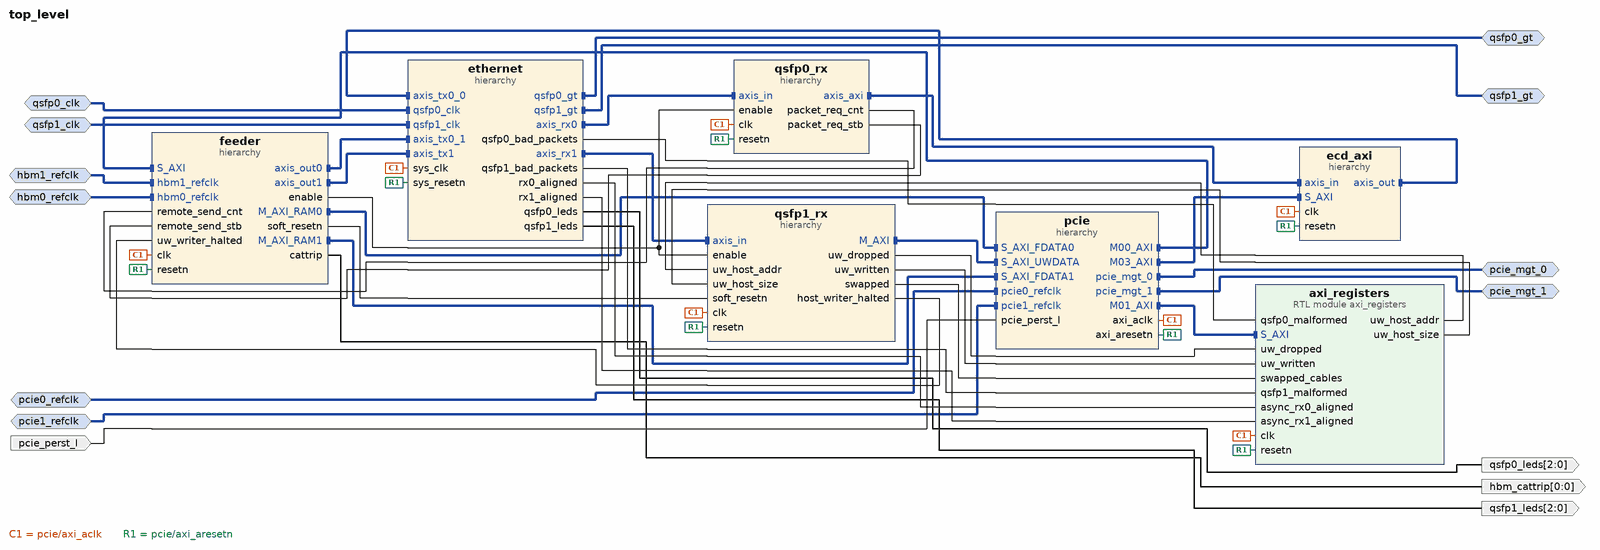
[diagram p0: block diagram of the top level]
# Vivado block design top_level, xcu55c-fsvh2892-2L-e, Vivado 2024.2
create_bd_design top_level

create_bd_intf_port -mode Slave -vlnv xilinx.com:interface:diff_clock_rtl:1.0 pcie0_refclk
create_bd_intf_port -mode Master -vlnv xilinx.com:interface:pcie_7x_mgt_rtl:1.0 pcie_mgt_0
create_bd_intf_port -mode Master -vlnv xilinx.com:interface:pcie_7x_mgt_rtl:1.0 pcie_mgt_1
create_bd_intf_port -mode Slave -vlnv xilinx.com:interface:diff_clock_rtl:1.0 pcie1_refclk
create_bd_intf_port -mode Master -vlnv xilinx.com:interface:gt_rtl:1.0 qsfp0_gt
create_bd_intf_port -mode Slave -vlnv xilinx.com:interface:diff_clock_rtl:1.0 qsfp0_clk
set_property -dict {CONFIG.FREQ_HZ 161132812} [get_bd_intf_ports qsfp0_clk]
create_bd_intf_port -mode Slave -vlnv xilinx.com:interface:diff_clock_rtl:1.0 qsfp1_clk
set_property -dict {CONFIG.FREQ_HZ 161132812} [get_bd_intf_ports qsfp1_clk]
create_bd_intf_port -mode Master -vlnv xilinx.com:interface:gt_rtl:1.0 qsfp1_gt
create_bd_intf_port -mode Slave -vlnv xilinx.com:interface:diff_clock_rtl:1.0 hbm0_refclk
create_bd_intf_port -mode Slave -vlnv xilinx.com:interface:diff_clock_rtl:1.0 hbm1_refclk
create_bd_port -dir O -from 0 -to 0 hbm_cattrip
create_bd_port -dir I -type rst pcie_perst_l
create_bd_port -dir O -from 2 -to 0 qsfp0_leds
create_bd_port -dir O -from 2 -to 0 qsfp1_leds

create_bd_cell -type hier pcie
create_bd_cell -type hier feeder
create_bd_cell -type hier ethernet
create_bd_cell -type hier qsfp0_rx
create_bd_cell -type module -reference axi_registers axi_registers
create_bd_cell -type hier qsfp1_rx
create_bd_cell -type hier ecd_axi

# ---- hierarchy /pcie ----
current_bd_instance /pcie
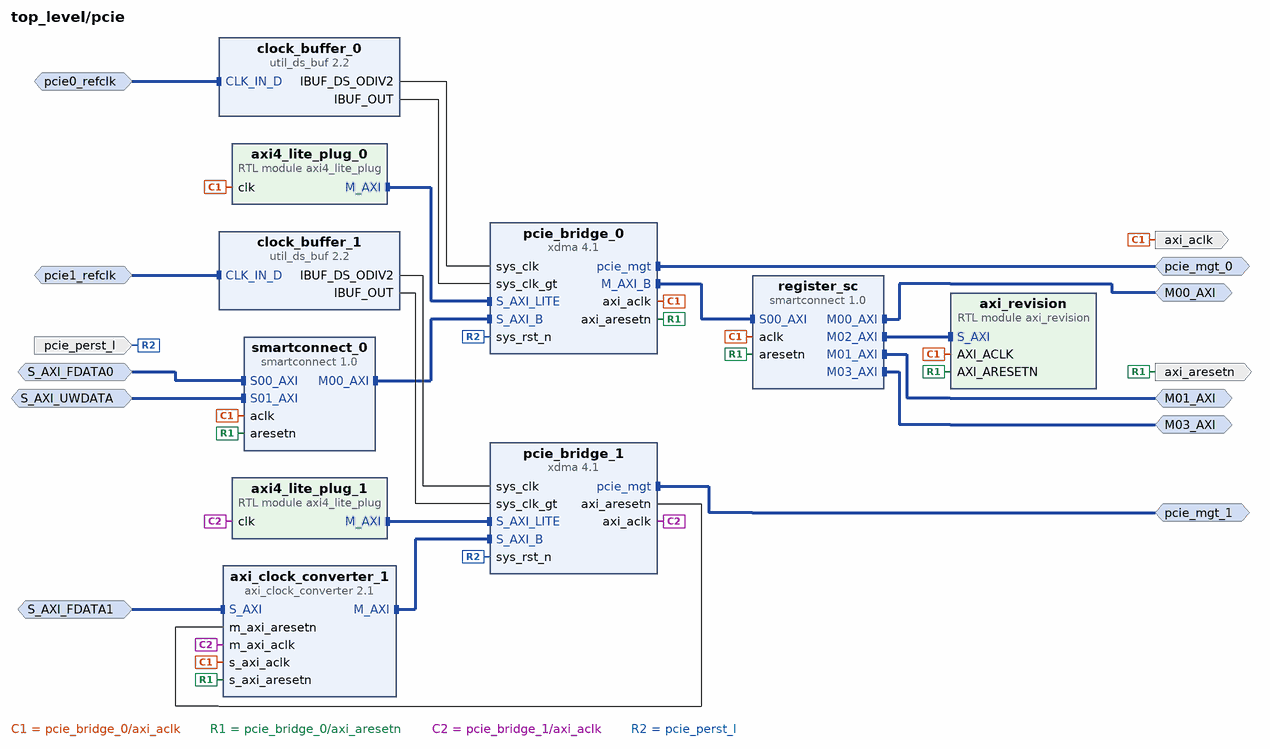
[diagram p1: block diagram inside /pcie]
create_bd_intf_pin -mode Slave -vlnv xilinx.com:interface:diff_clock_rtl:1.0 pcie1_refclk
create_bd_intf_pin -mode Master -vlnv xilinx.com:interface:pcie_7x_mgt_rtl:1.0 pcie_mgt_0
create_bd_intf_pin -mode Master -vlnv xilinx.com:interface:pcie_7x_mgt_rtl:1.0 pcie_mgt_1
create_bd_intf_pin -mode Slave -vlnv xilinx.com:interface:diff_clock_rtl:1.0 pcie0_refclk
create_bd_intf_pin -mode Slave -vlnv xilinx.com:interface:aximm_rtl:1.0 S_AXI_FDATA1
create_bd_intf_pin -mode Slave -vlnv xilinx.com:interface:aximm_rtl:1.0 S_AXI_FDATA0
create_bd_intf_pin -mode Slave -vlnv xilinx.com:interface:aximm_rtl:1.0 S_AXI_UWDATA
create_bd_intf_pin -mode Master -vlnv xilinx.com:interface:aximm_rtl:1.0 M00_AXI
create_bd_intf_pin -mode Master -vlnv xilinx.com:interface:aximm_rtl:1.0 M01_AXI
create_bd_intf_pin -mode Master -vlnv xilinx.com:interface:aximm_rtl:1.0 M03_AXI
create_bd_pin -dir I -type rst pcie_perst_l
create_bd_pin -dir O axi_aresetn
create_bd_pin -dir O axi_aclk

create_bd_cell -type ip -vlnv xilinx.com:ip:util_ds_buf:2.2 clock_buffer_1
set_property -dict {CONFIG.C_BUF_TYPE IBUFDSGTE} [get_bd_cells clock_buffer_1]
create_bd_cell -type ip -vlnv xilinx.com:ip:xdma:4.1 pcie_bridge_0
set_property -dict [list \
  CONFIG.PF0_DEVICE_ID_mqdma 9048 \
  CONFIG.PF0_SRIOV_VF_DEVICE_ID A048 \
  CONFIG.PF2_DEVICE_ID_mqdma 9248 \
  CONFIG.PF3_DEVICE_ID_mqdma 9348 \
  CONFIG.axi_addr_width 64 \
  CONFIG.axi_data_width 512_bit \
  CONFIG.axisten_freq 250 \
  CONFIG.bridge_burst true \
  CONFIG.en_axi_slave_if true \
  CONFIG.en_gt_selection false \
  CONFIG.functional_mode AXI_Bridge \
  CONFIG.mode_selection Advanced \
  CONFIG.pcie_blk_locn PCIE4C_X1Y1 \
  CONFIG.pf0_bar0_scale Megabytes \
  CONFIG.pf0_bar0_size 1 \
  CONFIG.pf0_device_id 903F \
  CONFIG.pf0_msi_enabled false \
  CONFIG.pl_link_cap_max_link_speed 16.0_GT/s \
  CONFIG.pl_link_cap_max_link_width X8 \
  CONFIG.runbit_fix false \
  CONFIG.xlnx_ref_board None \
] [get_bd_cells pcie_bridge_0]
create_bd_cell -type ip -vlnv xilinx.com:ip:xdma:4.1 pcie_bridge_1
set_property -dict [list \
  CONFIG.PCIE_BOARD_INTERFACE Custom \
  CONFIG.PF0_DEVICE_ID_mqdma 9048 \
  CONFIG.PF0_SRIOV_VF_DEVICE_ID A048 \
  CONFIG.PF2_DEVICE_ID_mqdma 9248 \
  CONFIG.PF3_DEVICE_ID_mqdma 9348 \
  CONFIG.SYS_RST_N_BOARD_INTERFACE Custom \
  CONFIG.axi_addr_width 64 \
  CONFIG.axi_data_width 512_bit \
  CONFIG.axisten_freq 250 \
  CONFIG.bridge_burst true \
  CONFIG.en_axi_master_if false \
  CONFIG.en_axi_slave_if true \
  CONFIG.en_gt_selection true \
  CONFIG.functional_mode AXI_Bridge \
  CONFIG.mode_selection Advanced \
  CONFIG.pcie_blk_locn PCIE4C_X1Y0 \
  CONFIG.pf0_bar0_scale Megabytes \
  CONFIG.pf0_bar0_size 1 \
  CONFIG.pf0_device_id 9040 \
  CONFIG.pf0_msi_enabled false \
  CONFIG.pl_link_cap_max_link_speed 16.0_GT/s \
  CONFIG.pl_link_cap_max_link_width X8 \
  CONFIG.runbit_fix false \
  CONFIG.select_quad GTY_Quad_225 \
  CONFIG.xlnx_ref_board None \
] [get_bd_cells pcie_bridge_1]
create_bd_cell -type ip -vlnv xilinx.com:ip:util_ds_buf:2.2 clock_buffer_0
set_property -dict {CONFIG.C_BUF_TYPE IBUFDSGTE} [get_bd_cells clock_buffer_0]
create_bd_cell -type ip -vlnv xilinx.com:ip:smartconnect:1.0 smartconnect_0
set_property -dict {CONFIG.NUM_SI 2} [get_bd_cells smartconnect_0]
create_bd_cell -type module -reference axi4_lite_plug axi4_lite_plug_0
create_bd_cell -type module -reference axi4_lite_plug axi4_lite_plug_1
create_bd_cell -type ip -vlnv xilinx.com:ip:axi_clock_converter:2.1 axi_clock_converter_1
create_bd_cell -type ip -vlnv xilinx.com:ip:smartconnect:1.0 register_sc
set_property -dict {CONFIG.NUM_MI 4 CONFIG.NUM_SI 1} [get_bd_cells register_sc]
create_bd_cell -type module -reference axi_revision axi_revision

# ---- hierarchy /feeder ----
current_bd_instance /feeder
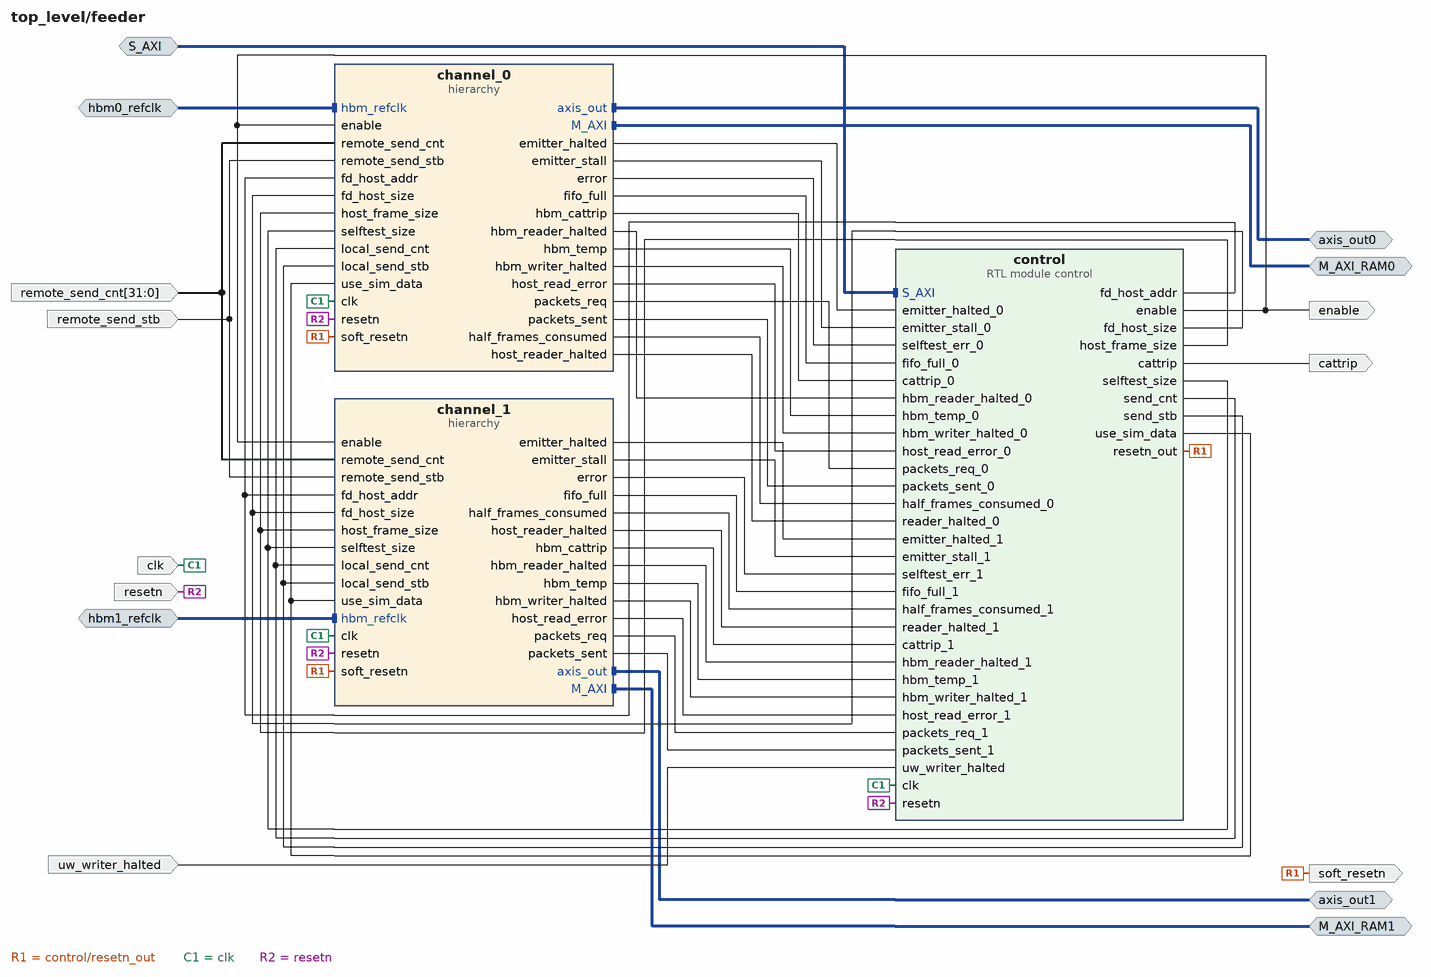
[diagram p2: block diagram inside /feeder]
create_bd_intf_pin -mode Slave -vlnv xilinx.com:interface:aximm_rtl:1.0 S_AXI
create_bd_intf_pin -mode Master -vlnv xilinx.com:interface:aximm_rtl:1.0 M_AXI_RAM0
create_bd_intf_pin -mode Master -vlnv xilinx.com:interface:axis_rtl:1.0 axis_out0
create_bd_intf_pin -mode Master -vlnv xilinx.com:interface:axis_rtl:1.0 axis_out1
create_bd_intf_pin -mode Master -vlnv xilinx.com:interface:aximm_rtl:1.0 M_AXI_RAM1
create_bd_intf_pin -mode Slave -vlnv xilinx.com:interface:diff_clock_rtl:1.0 hbm0_refclk
create_bd_intf_pin -mode Slave -vlnv xilinx.com:interface:diff_clock_rtl:1.0 hbm1_refclk
create_bd_pin -dir I -type clk clk
create_bd_pin -dir I -type rst resetn
create_bd_pin -dir I -from 31 -to 0 remote_send_cnt
create_bd_pin -dir I remote_send_stb
create_bd_pin -dir O cattrip
create_bd_pin -dir O enable
create_bd_pin -dir I uw_writer_halted
create_bd_pin -dir O soft_resetn

create_bd_cell -type hier channel_0
create_bd_cell -type hier channel_1
create_bd_cell -type module -reference control control

# ---- hierarchy /feeder/channel_0 ----
current_bd_instance /feeder/channel_0
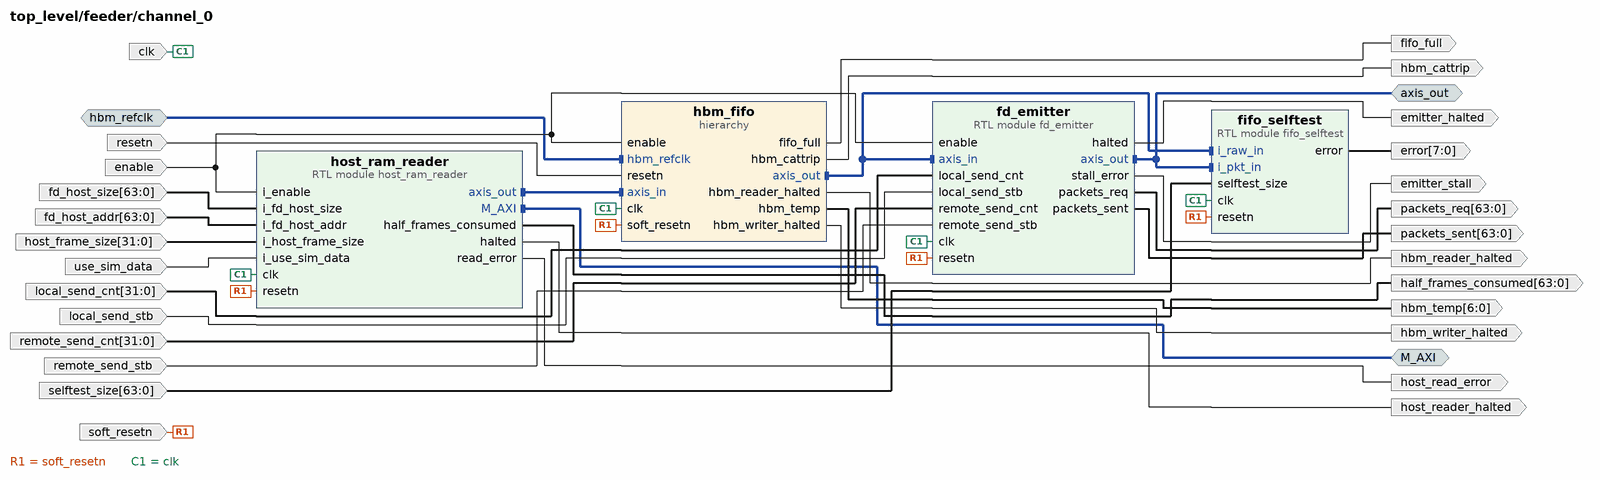
[diagram p3: block diagram inside /feeder/channel_0]
create_bd_intf_pin -mode Master -vlnv xilinx.com:interface:aximm_rtl:1.0 M_AXI
create_bd_intf_pin -mode Master -vlnv xilinx.com:interface:axis_rtl:1.0 axis_out
create_bd_intf_pin -mode Slave -vlnv xilinx.com:interface:diff_clock_rtl:1.0 hbm_refclk
create_bd_pin -dir I -type clk clk
create_bd_pin -dir I -type rst soft_resetn
create_bd_pin -dir I -from 31 -to 0 host_frame_size
create_bd_pin -dir I -from 63 -to 0 fd_host_addr
create_bd_pin -dir I -from 63 -to 0 fd_host_size
create_bd_pin -dir O -from 63 -to 0 half_frames_consumed
create_bd_pin -dir I enable
create_bd_pin -dir O host_reader_halted
create_bd_pin -dir I local_send_stb
create_bd_pin -dir I -from 31 -to 0 local_send_cnt
create_bd_pin -dir I remote_send_stb
create_bd_pin -dir I -from 31 -to 0 remote_send_cnt
create_bd_pin -dir I use_sim_data
create_bd_pin -dir O fifo_full
create_bd_pin -dir O -from 6 -to 0 hbm_temp
create_bd_pin -dir O hbm_cattrip
create_bd_pin -dir O -from 7 -to 0 error
create_bd_pin -dir O emitter_halted
create_bd_pin -dir O -from 63 -to 0 packets_req
create_bd_pin -dir O -from 63 -to 0 packets_sent
create_bd_pin -dir O host_read_error
create_bd_pin -dir O emitter_stall
create_bd_pin -dir O hbm_writer_halted
create_bd_pin -dir O hbm_reader_halted
create_bd_pin -dir I resetn
create_bd_pin -dir I -from 63 -to 0 selftest_size

create_bd_cell -type module -reference fd_emitter fd_emitter
set_property -dict {CONFIG.CHANNEL 0} [get_bd_cells fd_emitter]
create_bd_cell -type hier hbm_fifo
create_bd_cell -type module -reference fifo_selftest fifo_selftest
create_bd_cell -type module -reference host_ram_reader host_ram_reader

# ---- hierarchy /feeder/channel_0/hbm_fifo ----
current_bd_instance /feeder/channel_0/hbm_fifo
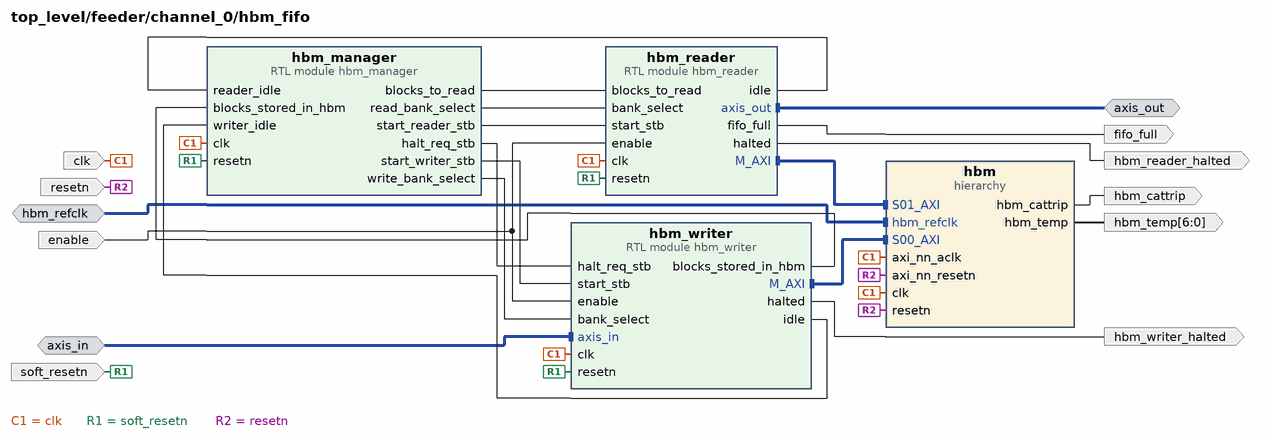
[diagram p4: block diagram inside /feeder/channel_0/hbm_fifo]
create_bd_intf_pin -mode Slave -vlnv xilinx.com:interface:axis_rtl:1.0 axis_in
create_bd_intf_pin -mode Master -vlnv xilinx.com:interface:axis_rtl:1.0 axis_out
create_bd_intf_pin -mode Slave -vlnv xilinx.com:interface:diff_clock_rtl:1.0 hbm_refclk
create_bd_pin -dir I clk
create_bd_pin -dir I soft_resetn
create_bd_pin -dir O fifo_full
create_bd_pin -dir O -from 6 -to 0 hbm_temp
create_bd_pin -dir O hbm_cattrip
create_bd_pin -dir O hbm_reader_halted
create_bd_pin -dir I enable
create_bd_pin -dir O hbm_writer_halted
create_bd_pin -dir I resetn

create_bd_cell -type module -reference hbm_manager hbm_manager
create_bd_cell -type module -reference hbm_reader hbm_reader
create_bd_cell -type module -reference hbm_writer hbm_writer
create_bd_cell -type hier hbm

# ---- hierarchy /feeder/channel_0/hbm_fifo/hbm ----
current_bd_instance /feeder/channel_0/hbm_fifo/hbm
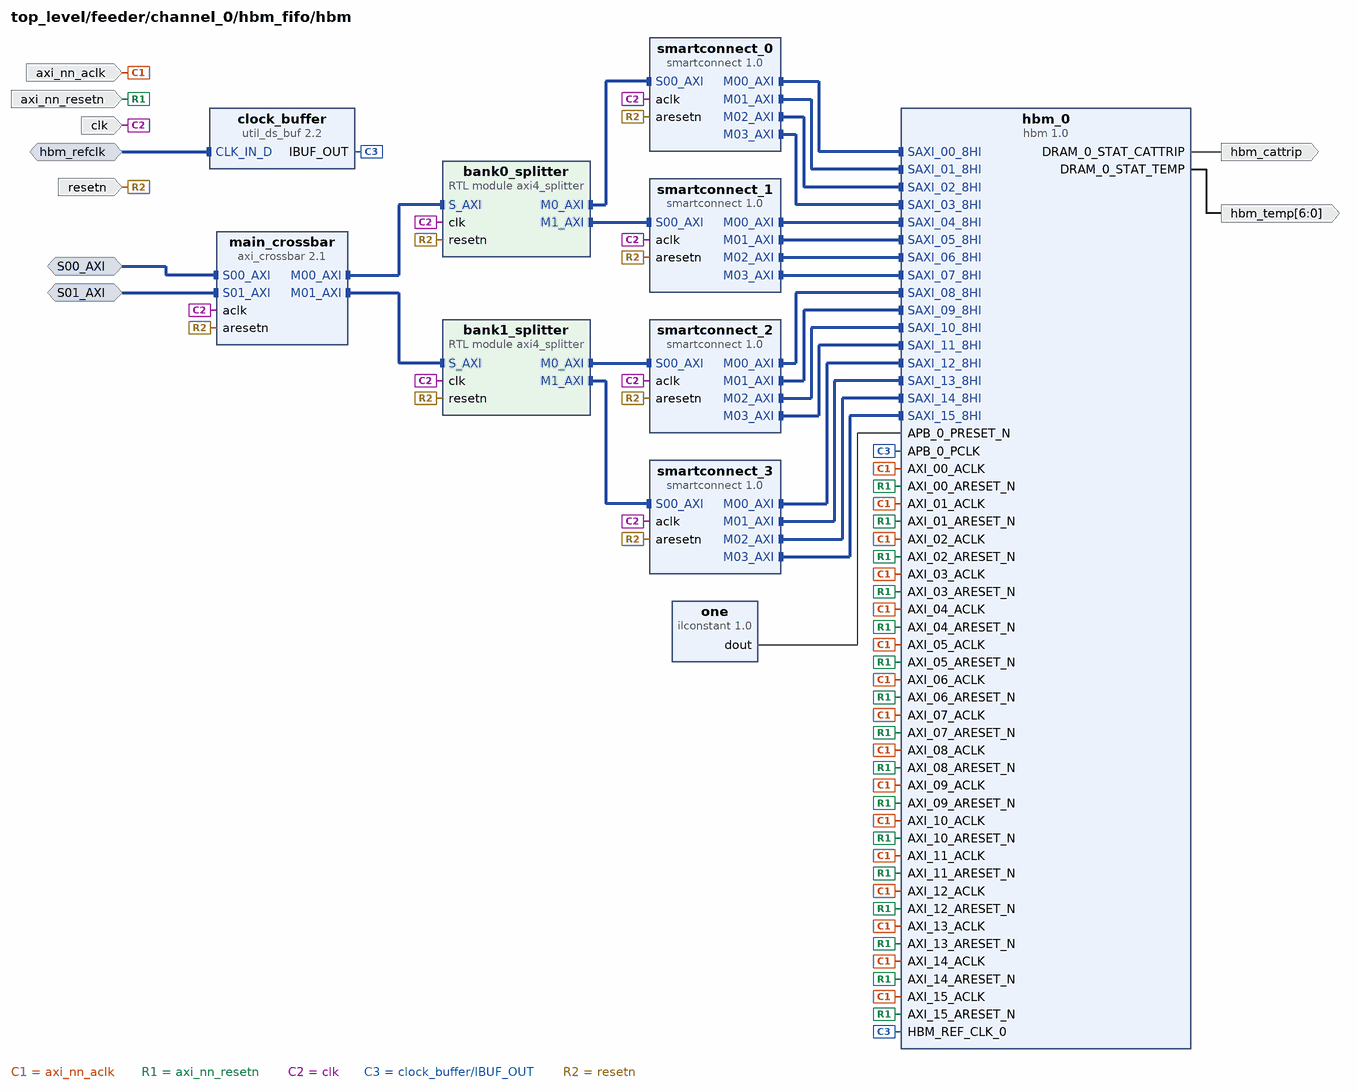
[diagram p5: block diagram inside /feeder/channel_0/hbm_fifo/hbm]
create_bd_intf_pin -mode Slave -vlnv xilinx.com:interface:diff_clock_rtl:1.0 hbm_refclk
create_bd_intf_pin -mode Slave -vlnv xilinx.com:interface:aximm_rtl:1.0 S00_AXI
create_bd_intf_pin -mode Slave -vlnv xilinx.com:interface:aximm_rtl:1.0 S01_AXI
create_bd_pin -dir I axi_nn_aclk
create_bd_pin -dir I axi_nn_resetn
create_bd_pin -dir O -from 6 -to 0 hbm_temp
create_bd_pin -dir O hbm_cattrip
create_bd_pin -dir I clk
create_bd_pin -dir I resetn

create_bd_cell -type ip -vlnv xilinx.com:ip:hbm:1.0 hbm_0
set_property -dict [list \
  CONFIG.USER_APB_EN false \
  CONFIG.USER_MC0_ENABLE_ECC_CORRECTION true \
  CONFIG.USER_MC0_TRAFFIC_OPTION Linear \
  CONFIG.USER_SWITCH_ENABLE_00 FALSE \
] [get_bd_cells hbm_0]
create_bd_cell -type inline_hdl -vlnv xilinx.com:inline_hdl:ilconstant:1.0 one
create_bd_cell -type ip -vlnv xilinx.com:ip:util_ds_buf:2.2 clock_buffer
create_bd_cell -type module -reference axi4_splitter bank0_splitter
set_property -dict {CONFIG.BASE_ADDR1 0x0000000080000000} [get_bd_cells bank0_splitter]
create_bd_cell -type module -reference axi4_splitter bank1_splitter
set_property -dict [list \
  CONFIG.ADDR_OFFSET 0x0000000100000000 \
  CONFIG.BASE_ADDR0 0x0000000100000000 \
  CONFIG.BASE_ADDR1 0x0000000180000000 \
] [get_bd_cells bank1_splitter]
create_bd_cell -type ip -vlnv xilinx.com:ip:axi_crossbar:2.1 main_crossbar
set_property -dict {CONFIG.NUM_SI 2 CONFIG.STRATEGY 2} [get_bd_cells main_crossbar]
create_bd_cell -type ip -vlnv xilinx.com:ip:smartconnect:1.0 smartconnect_0
set_property -dict [list \
  CONFIG.ADVANCED_PROPERTIES {     __view__ { functional { M00_Buffer { AW_SIZE 4 } } }    } \
  CONFIG.NUM_MI 4 \
  CONFIG.NUM_SI 1 \
] [get_bd_cells smartconnect_0]
create_bd_cell -type ip -vlnv xilinx.com:ip:smartconnect:1.0 smartconnect_1
set_property -dict {CONFIG.NUM_MI 4 CONFIG.NUM_SI 1} [get_bd_cells smartconnect_1]
create_bd_cell -type ip -vlnv xilinx.com:ip:smartconnect:1.0 smartconnect_2
set_property -dict {CONFIG.NUM_MI 4 CONFIG.NUM_SI 1} [get_bd_cells smartconnect_2]
create_bd_cell -type ip -vlnv xilinx.com:ip:smartconnect:1.0 smartconnect_3
set_property -dict {CONFIG.NUM_MI 4 CONFIG.NUM_SI 1} [get_bd_cells smartconnect_3]

# ---- hierarchy /feeder/channel_1 ----
current_bd_instance /feeder/channel_1
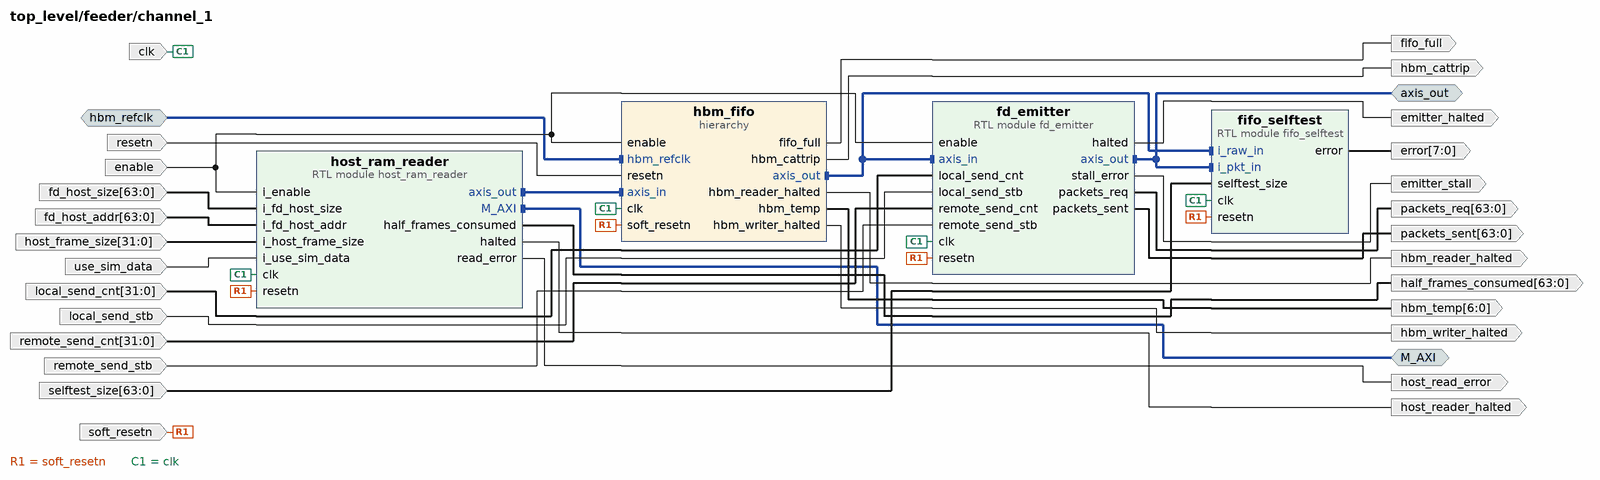
[diagram p6: block diagram inside /feeder/channel_1]
create_bd_intf_pin -mode Master -vlnv xilinx.com:interface:aximm_rtl:1.0 M_AXI
create_bd_intf_pin -mode Master -vlnv xilinx.com:interface:axis_rtl:1.0 axis_out
create_bd_intf_pin -mode Slave -vlnv xilinx.com:interface:diff_clock_rtl:1.0 hbm_refclk
create_bd_pin -dir I -type clk clk
create_bd_pin -dir I -type rst soft_resetn
create_bd_pin -dir I -from 31 -to 0 host_frame_size
create_bd_pin -dir I -from 63 -to 0 fd_host_addr
create_bd_pin -dir I -from 63 -to 0 fd_host_size
create_bd_pin -dir O -from 63 -to 0 half_frames_consumed
create_bd_pin -dir I enable
create_bd_pin -dir O host_reader_halted
create_bd_pin -dir I local_send_stb
create_bd_pin -dir I -from 31 -to 0 local_send_cnt
create_bd_pin -dir I remote_send_stb
create_bd_pin -dir I -from 31 -to 0 remote_send_cnt
create_bd_pin -dir I use_sim_data
create_bd_pin -dir O fifo_full
create_bd_pin -dir O -from 6 -to 0 hbm_temp
create_bd_pin -dir O hbm_cattrip
create_bd_pin -dir O -from 7 -to 0 error
create_bd_pin -dir O emitter_halted
create_bd_pin -dir O -from 63 -to 0 packets_req
create_bd_pin -dir O -from 63 -to 0 packets_sent
create_bd_pin -dir O host_read_error
create_bd_pin -dir O emitter_stall
create_bd_pin -dir O hbm_writer_halted
create_bd_pin -dir O hbm_reader_halted
create_bd_pin -dir I resetn
create_bd_pin -dir I -from 63 -to 0 selftest_size

create_bd_cell -type module -reference fd_emitter fd_emitter
set_property -dict {CONFIG.CHANNEL 1} [get_bd_cells fd_emitter]
create_bd_cell -type hier hbm_fifo
create_bd_cell -type module -reference fifo_selftest fifo_selftest
set_property -dict {CONFIG.CHANNEL 1} [get_bd_cells fifo_selftest]
create_bd_cell -type module -reference host_ram_reader host_ram_reader
set_property -dict {CONFIG.CHANNEL 1} [get_bd_cells host_ram_reader]

# ---- hierarchy /feeder/channel_1/hbm_fifo ----
current_bd_instance /feeder/channel_1/hbm_fifo
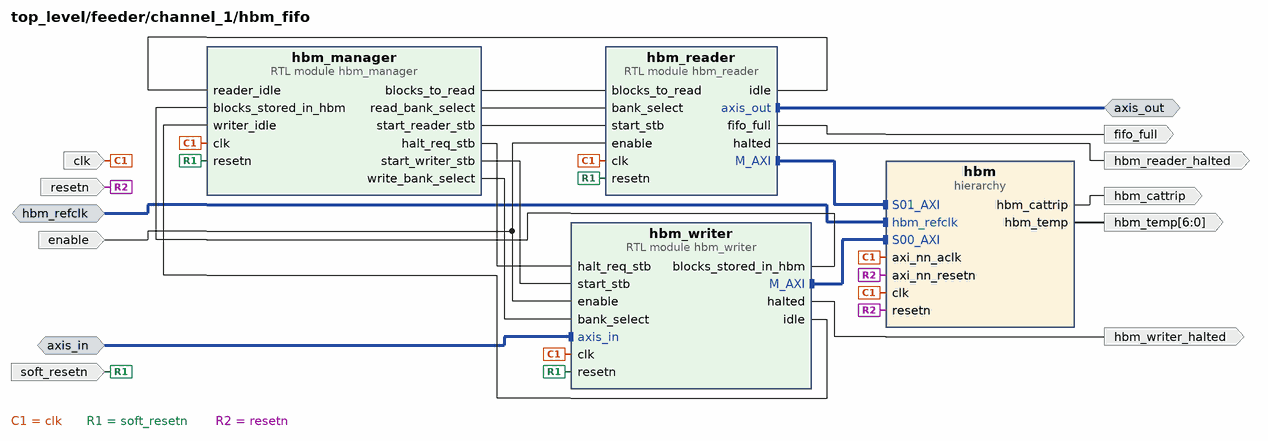
[diagram p7: block diagram inside /feeder/channel_1/hbm_fifo]
create_bd_intf_pin -mode Slave -vlnv xilinx.com:interface:axis_rtl:1.0 axis_in
create_bd_intf_pin -mode Master -vlnv xilinx.com:interface:axis_rtl:1.0 axis_out
create_bd_intf_pin -mode Slave -vlnv xilinx.com:interface:diff_clock_rtl:1.0 hbm_refclk
create_bd_pin -dir I clk
create_bd_pin -dir I soft_resetn
create_bd_pin -dir O fifo_full
create_bd_pin -dir O -from 6 -to 0 hbm_temp
create_bd_pin -dir O hbm_cattrip
create_bd_pin -dir I enable
create_bd_pin -dir O hbm_writer_halted
create_bd_pin -dir O hbm_reader_halted
create_bd_pin -dir I resetn

create_bd_cell -type module -reference hbm_manager hbm_manager
create_bd_cell -type module -reference hbm_reader hbm_reader
create_bd_cell -type module -reference hbm_writer hbm_writer
create_bd_cell -type hier hbm

# ---- hierarchy /feeder/channel_1/hbm_fifo/hbm ----
current_bd_instance /feeder/channel_1/hbm_fifo/hbm
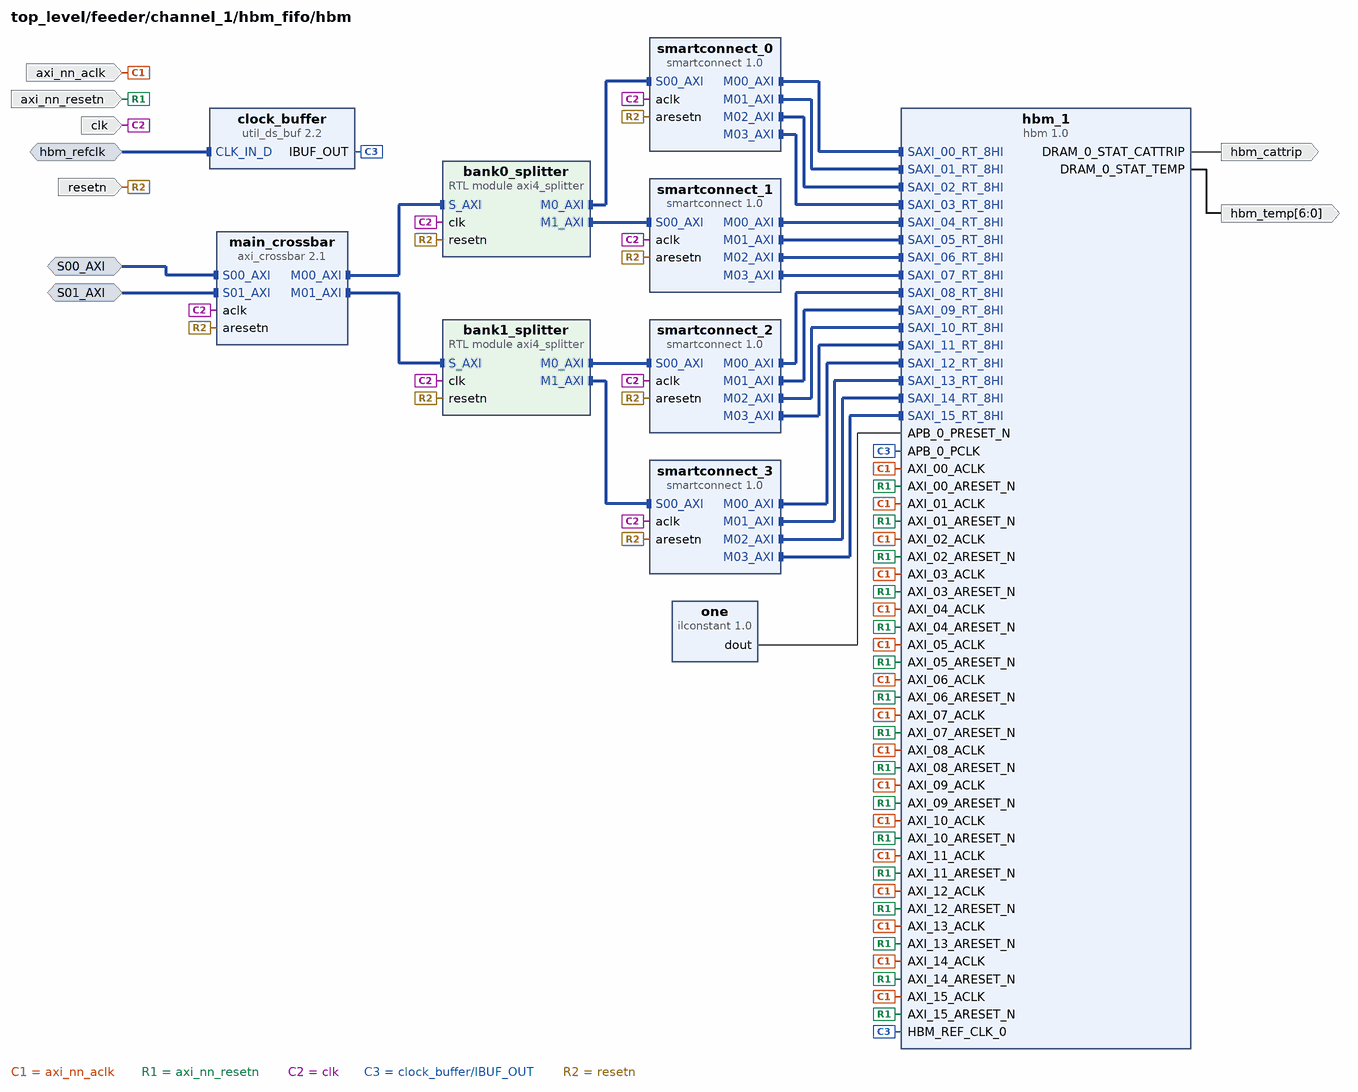
[diagram p8: block diagram inside /feeder/channel_1/hbm_fifo/hbm]
create_bd_intf_pin -mode Slave -vlnv xilinx.com:interface:diff_clock_rtl:1.0 hbm_refclk
create_bd_intf_pin -mode Slave -vlnv xilinx.com:interface:aximm_rtl:1.0 S00_AXI
create_bd_intf_pin -mode Slave -vlnv xilinx.com:interface:aximm_rtl:1.0 S01_AXI
create_bd_pin -dir I axi_nn_aclk
create_bd_pin -dir I axi_nn_resetn
create_bd_pin -dir O -from 6 -to 0 hbm_temp
create_bd_pin -dir O hbm_cattrip
create_bd_pin -dir I clk
create_bd_pin -dir I resetn

create_bd_cell -type ip -vlnv xilinx.com:ip:hbm:1.0 hbm_1
set_property -dict [list \
  CONFIG.USER_APB_EN false \
  CONFIG.USER_MC0_ENABLE_ECC_CORRECTION true \
  CONFIG.USER_MC0_TRAFFIC_OPTION Linear \
  CONFIG.USER_SINGLE_STACK_SELECTION RIGHT \
  CONFIG.USER_SWITCH_ENABLE_00 FALSE \
] [get_bd_cells hbm_1]
create_bd_cell -type inline_hdl -vlnv xilinx.com:inline_hdl:ilconstant:1.0 one
create_bd_cell -type ip -vlnv xilinx.com:ip:util_ds_buf:2.2 clock_buffer
create_bd_cell -type module -reference axi4_splitter bank0_splitter
set_property -dict {CONFIG.BASE_ADDR0 0x0000000200000000 CONFIG.BASE_ADDR1 0x0000000280000000} [get_bd_cells bank0_splitter]
create_bd_cell -type module -reference axi4_splitter bank1_splitter
set_property -dict [list \
  CONFIG.ADDR_OFFSET 0x0000000100000000 \
  CONFIG.BASE_ADDR0 0x0000000300000000 \
  CONFIG.BASE_ADDR1 0x0000000380000000 \
] [get_bd_cells bank1_splitter]
create_bd_cell -type ip -vlnv xilinx.com:ip:axi_crossbar:2.1 main_crossbar
set_property -dict {CONFIG.NUM_SI 2 CONFIG.STRATEGY 2} [get_bd_cells main_crossbar]
create_bd_cell -type ip -vlnv xilinx.com:ip:smartconnect:1.0 smartconnect_0
set_property -dict [list \
  CONFIG.ADVANCED_PROPERTIES {     __view__ { functional { M00_Buffer { AW_SIZE 4 } } }    } \
  CONFIG.NUM_MI 4 \
  CONFIG.NUM_SI 1 \
] [get_bd_cells smartconnect_0]
create_bd_cell -type ip -vlnv xilinx.com:ip:smartconnect:1.0 smartconnect_1
set_property -dict {CONFIG.NUM_MI 4 CONFIG.NUM_SI 1} [get_bd_cells smartconnect_1]
create_bd_cell -type ip -vlnv xilinx.com:ip:smartconnect:1.0 smartconnect_2
set_property -dict {CONFIG.NUM_MI 4 CONFIG.NUM_SI 1} [get_bd_cells smartconnect_2]
create_bd_cell -type ip -vlnv xilinx.com:ip:smartconnect:1.0 smartconnect_3
set_property -dict {CONFIG.NUM_MI 4 CONFIG.NUM_SI 1} [get_bd_cells smartconnect_3]

# ---- hierarchy /ethernet ----
current_bd_instance /ethernet
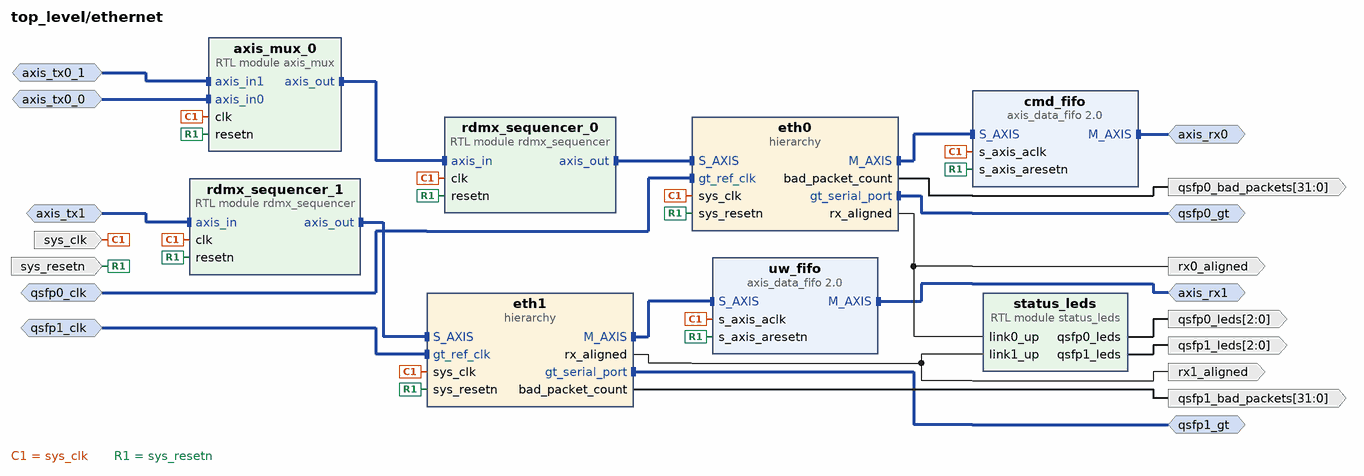
[diagram p9: block diagram inside /ethernet]
create_bd_intf_pin -mode Master -vlnv xilinx.com:interface:gt_rtl:1.0 qsfp0_gt
create_bd_intf_pin -mode Slave -vlnv xilinx.com:interface:diff_clock_rtl:1.0 qsfp0_clk
create_bd_intf_pin -mode Slave -vlnv xilinx.com:interface:axis_rtl:1.0 axis_tx0_1
create_bd_intf_pin -mode Master -vlnv xilinx.com:interface:axis_rtl:1.0 axis_rx0
create_bd_intf_pin -mode Master -vlnv xilinx.com:interface:gt_rtl:1.0 qsfp1_gt
create_bd_intf_pin -mode Slave -vlnv xilinx.com:interface:diff_clock_rtl:1.0 qsfp1_clk
create_bd_intf_pin -mode Master -vlnv xilinx.com:interface:axis_rtl:1.0 axis_rx1
create_bd_intf_pin -mode Slave -vlnv xilinx.com:interface:axis_rtl:1.0 axis_tx1
create_bd_intf_pin -mode Slave -vlnv xilinx.com:interface:axis_rtl:1.0 axis_tx0_0
create_bd_pin -dir I sys_clk
create_bd_pin -dir I sys_resetn
create_bd_pin -dir O -from 2 -to 0 qsfp0_leds
create_bd_pin -dir O -from 2 -to 0 qsfp1_leds
create_bd_pin -dir O rx1_aligned
create_bd_pin -dir O rx0_aligned
create_bd_pin -dir O -from 31 -to 0 qsfp0_bad_packets
create_bd_pin -dir O -from 31 -to 0 qsfp1_bad_packets

create_bd_cell -type hier eth0
create_bd_cell -type hier eth1
create_bd_cell -type ip -vlnv xilinx.com:ip:axis_data_fifo:2.0 uw_fifo
set_property -dict {CONFIG.FIFO_DEPTH 2048} [get_bd_cells uw_fifo]
create_bd_cell -type module -reference rdmx_sequencer rdmx_sequencer_0
create_bd_cell -type module -reference rdmx_sequencer rdmx_sequencer_1
create_bd_cell -type ip -vlnv xilinx.com:ip:axis_data_fifo:2.0 cmd_fifo
set_property -dict {CONFIG.FIFO_DEPTH 16} [get_bd_cells cmd_fifo]
create_bd_cell -type module -reference status_leds status_leds
create_bd_cell -type module -reference axis_mux axis_mux_0

# ---- hierarchy /ethernet/eth0 ----
current_bd_instance /ethernet/eth0
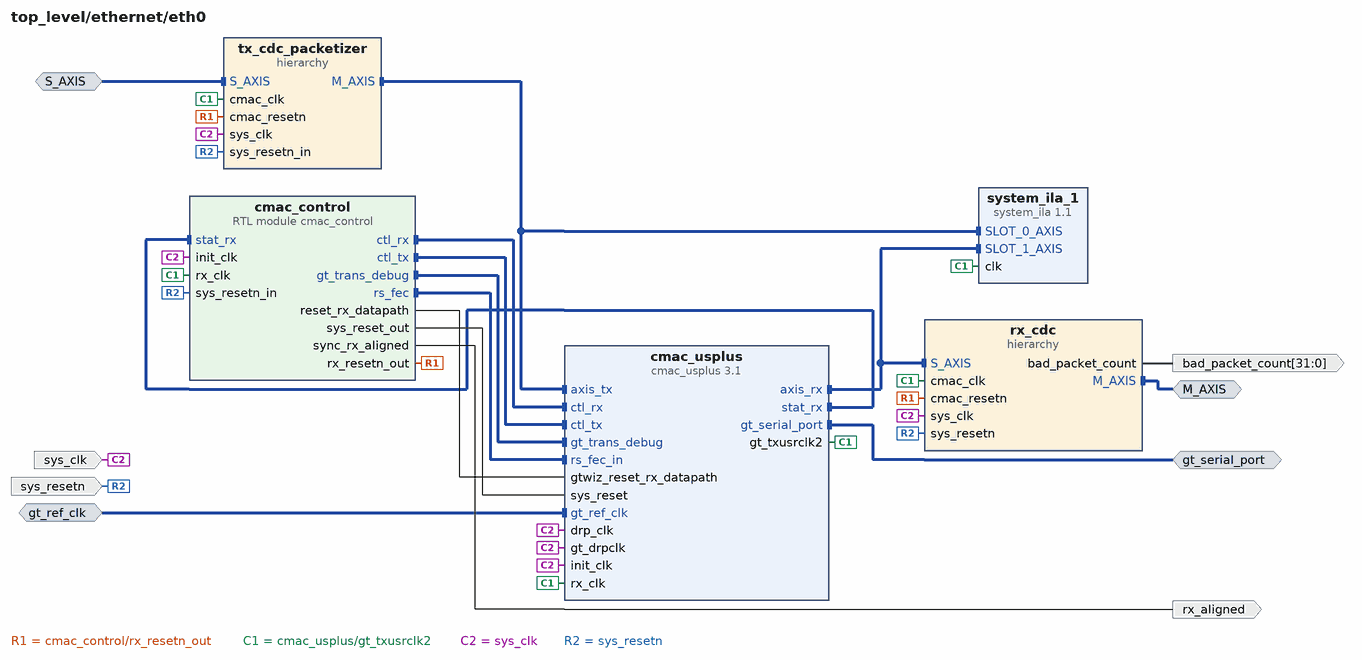
[diagram p10: block diagram inside /ethernet/eth0]
create_bd_intf_pin -mode Master -vlnv xilinx.com:interface:gt_rtl:1.0 gt_serial_port
create_bd_intf_pin -mode Slave -vlnv xilinx.com:interface:diff_clock_rtl:1.0 gt_ref_clk
create_bd_intf_pin -mode Slave -vlnv xilinx.com:interface:axis_rtl:1.0 S_AXIS
create_bd_intf_pin -mode Master -vlnv xilinx.com:interface:axis_rtl:1.0 M_AXIS
create_bd_pin -dir I sys_clk
create_bd_pin -dir I sys_resetn
create_bd_pin -dir O rx_aligned
create_bd_pin -dir O -from 31 -to 0 bad_packet_count

create_bd_cell -type module -reference cmac_control cmac_control
set_property -dict {CONFIG.USE_SYS_RESET_OUT 1} [get_bd_cells cmac_control]
create_bd_cell -type ip -vlnv xilinx.com:ip:cmac_usplus:3.1 cmac_usplus
set_property -dict [list \
  CONFIG.ADD_GT_CNRL_STS_PORTS 1 \
  CONFIG.CMAC_CAUI4_MODE 1 \
  CONFIG.GT_DRP_CLK 250 \
  CONFIG.INCLUDE_RS_FEC 1 \
  CONFIG.RX_FLOW_CONTROL 0 \
  CONFIG.TX_FLOW_CONTROL 0 \
  CONFIG.USER_INTERFACE AXIS \
] [get_bd_cells cmac_usplus]
create_bd_cell -type hier tx_cdc_packetizer
create_bd_cell -type hier rx_cdc
create_bd_cell -type ip -vlnv xilinx.com:ip:system_ila:1.1 system_ila_1
set_property -dict [list \
  CONFIG.C_NUM_MONITOR_SLOTS 2 \
  CONFIG.C_SLOT 1 \
  CONFIG.C_SLOT_0_INTF_TYPE xilinx.com:interface:axis_rtl:1.0 \
  CONFIG.C_SLOT_1_INTF_TYPE xilinx.com:interface:axis_rtl:1.0 \
] [get_bd_cells system_ila_1]

# ---- hierarchy /ethernet/eth0/tx_cdc_packetizer ----
current_bd_instance /ethernet/eth0/tx_cdc_packetizer
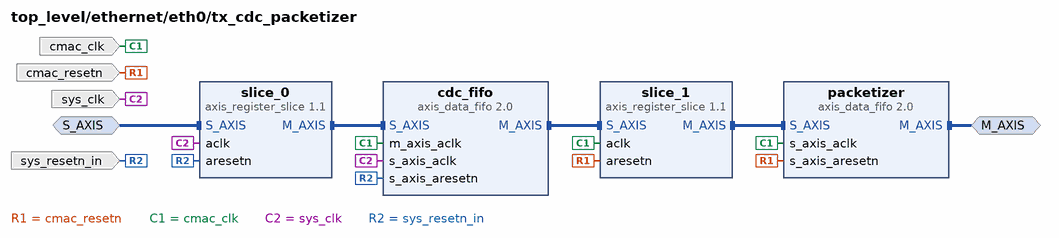
[diagram p11: block diagram inside /ethernet/eth0/tx_cdc_packetizer]
create_bd_intf_pin -mode Slave -vlnv xilinx.com:interface:axis_rtl:1.0 S_AXIS
create_bd_intf_pin -mode Master -vlnv xilinx.com:interface:axis_rtl:1.0 M_AXIS
create_bd_pin -dir I sys_resetn_in
create_bd_pin -dir I sys_clk
create_bd_pin -dir I -type clk cmac_clk
create_bd_pin -dir I cmac_resetn

create_bd_cell -type ip -vlnv xilinx.com:ip:axis_data_fifo:2.0 cdc_fifo
set_property -dict {CONFIG.FIFO_DEPTH 16 CONFIG.IS_ACLK_ASYNC 1} [get_bd_cells cdc_fifo]
create_bd_cell -type ip -vlnv xilinx.com:ip:axis_data_fifo:2.0 packetizer
set_property -dict {CONFIG.FIFO_DEPTH 128 CONFIG.FIFO_MODE 2} [get_bd_cells packetizer]
create_bd_cell -type ip -vlnv xilinx.com:ip:axis_register_slice:1.1 slice_1
create_bd_cell -type ip -vlnv xilinx.com:ip:axis_register_slice:1.1 slice_0
set_property -dict {CONFIG.REG_CONFIG 8} [get_bd_cells slice_0]

# ---- hierarchy /ethernet/eth0/rx_cdc ----
current_bd_instance /ethernet/eth0/rx_cdc
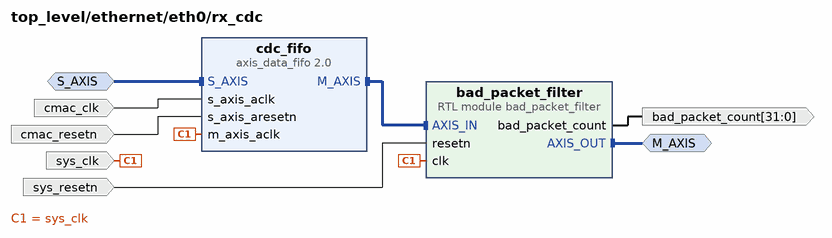
[diagram p12: block diagram inside /ethernet/eth0/rx_cdc]
create_bd_intf_pin -mode Slave -vlnv xilinx.com:interface:axis_rtl:1.0 S_AXIS
create_bd_intf_pin -mode Master -vlnv xilinx.com:interface:axis_rtl:1.0 M_AXIS
create_bd_pin -dir I cmac_clk
create_bd_pin -dir I cmac_resetn
create_bd_pin -dir I sys_clk
create_bd_pin -dir I sys_resetn
create_bd_pin -dir O -from 31 -to 0 bad_packet_count

create_bd_cell -type ip -vlnv xilinx.com:ip:axis_data_fifo:2.0 cdc_fifo
set_property -dict {CONFIG.FIFO_DEPTH 16 CONFIG.IS_ACLK_ASYNC 1} [get_bd_cells cdc_fifo]
create_bd_cell -type module -reference bad_packet_filter bad_packet_filter

# ---- hierarchy /ethernet/eth1 ----
current_bd_instance /ethernet/eth1
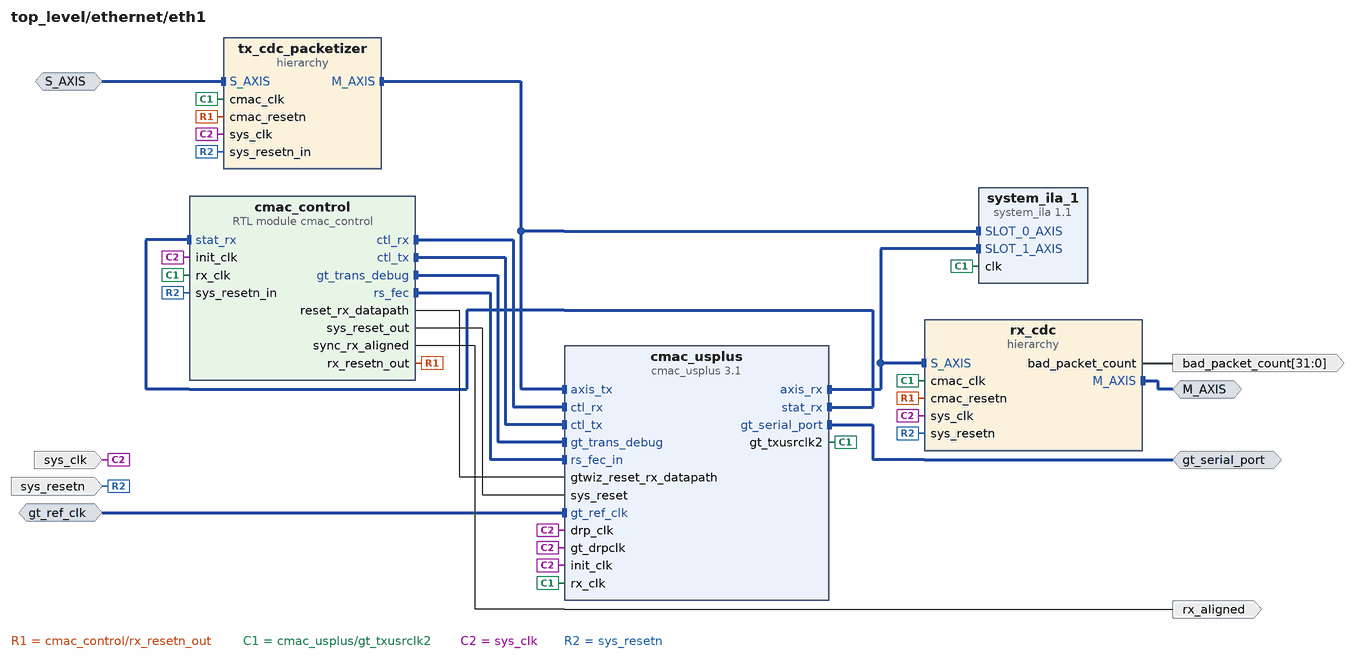
[diagram p13: block diagram inside /ethernet/eth1]
create_bd_intf_pin -mode Master -vlnv xilinx.com:interface:gt_rtl:1.0 gt_serial_port
create_bd_intf_pin -mode Slave -vlnv xilinx.com:interface:diff_clock_rtl:1.0 gt_ref_clk
create_bd_intf_pin -mode Slave -vlnv xilinx.com:interface:axis_rtl:1.0 S_AXIS
create_bd_intf_pin -mode Master -vlnv xilinx.com:interface:axis_rtl:1.0 M_AXIS
create_bd_pin -dir I sys_clk
create_bd_pin -dir I sys_resetn
create_bd_pin -dir O rx_aligned
create_bd_pin -dir O -from 31 -to 0 bad_packet_count

create_bd_cell -type module -reference cmac_control cmac_control
set_property -dict {CONFIG.USE_SYS_RESET_OUT 1} [get_bd_cells cmac_control]
create_bd_cell -type ip -vlnv xilinx.com:ip:cmac_usplus:3.1 cmac_usplus
set_property -dict [list \
  CONFIG.ADD_GT_CNRL_STS_PORTS 1 \
  CONFIG.CMAC_CAUI4_MODE 1 \
  CONFIG.CMAC_CORE_SELECT CMACE4_X0Y4 \
  CONFIG.GT_DRP_CLK 250 \
  CONFIG.GT_GROUP_SELECT {X0Y28~X0Y31} \
  CONFIG.INCLUDE_RS_FEC 1 \
  CONFIG.RX_FLOW_CONTROL 0 \
  CONFIG.TX_FLOW_CONTROL 0 \
  CONFIG.USER_INTERFACE AXIS \
] [get_bd_cells cmac_usplus]
create_bd_cell -type hier tx_cdc_packetizer
create_bd_cell -type hier rx_cdc
create_bd_cell -type ip -vlnv xilinx.com:ip:system_ila:1.1 system_ila_1
set_property -dict [list \
  CONFIG.C_NUM_MONITOR_SLOTS 2 \
  CONFIG.C_SLOT 1 \
  CONFIG.C_SLOT_0_INTF_TYPE xilinx.com:interface:axis_rtl:1.0 \
  CONFIG.C_SLOT_1_INTF_TYPE xilinx.com:interface:axis_rtl:1.0 \
] [get_bd_cells system_ila_1]

# ---- hierarchy /ethernet/eth1/tx_cdc_packetizer ----
current_bd_instance /ethernet/eth1/tx_cdc_packetizer
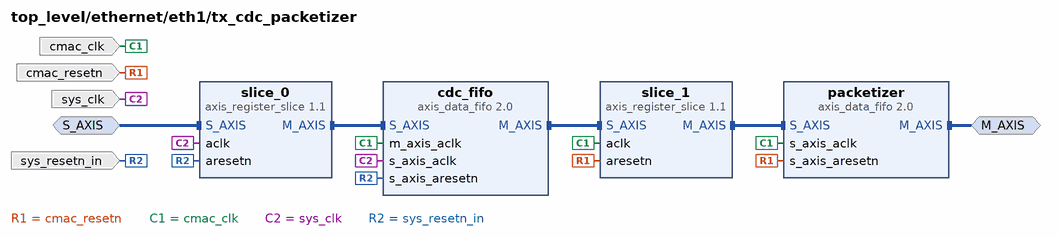
[diagram p14: block diagram inside /ethernet/eth1/tx_cdc_packetizer]
create_bd_intf_pin -mode Slave -vlnv xilinx.com:interface:axis_rtl:1.0 S_AXIS
create_bd_intf_pin -mode Master -vlnv xilinx.com:interface:axis_rtl:1.0 M_AXIS
create_bd_pin -dir I sys_resetn_in
create_bd_pin -dir I sys_clk
create_bd_pin -dir I -type clk cmac_clk
create_bd_pin -dir I cmac_resetn

create_bd_cell -type ip -vlnv xilinx.com:ip:axis_data_fifo:2.0 cdc_fifo
set_property -dict {CONFIG.FIFO_DEPTH 16 CONFIG.IS_ACLK_ASYNC 1} [get_bd_cells cdc_fifo]
create_bd_cell -type ip -vlnv xilinx.com:ip:axis_data_fifo:2.0 packetizer
set_property -dict {CONFIG.FIFO_DEPTH 128 CONFIG.FIFO_MODE 2} [get_bd_cells packetizer]
create_bd_cell -type ip -vlnv xilinx.com:ip:axis_register_slice:1.1 slice_1
create_bd_cell -type ip -vlnv xilinx.com:ip:axis_register_slice:1.1 slice_0
set_property -dict {CONFIG.REG_CONFIG 8} [get_bd_cells slice_0]

# ---- hierarchy /ethernet/eth1/rx_cdc ----
current_bd_instance /ethernet/eth1/rx_cdc
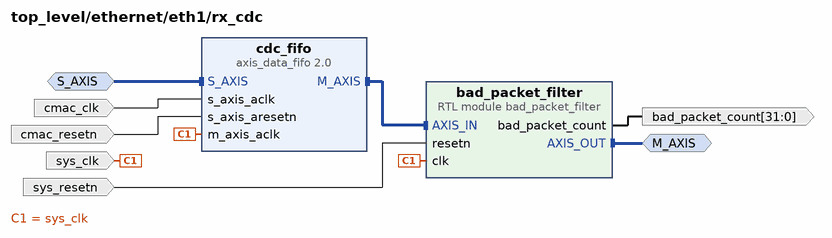
[diagram p15: block diagram inside /ethernet/eth1/rx_cdc]
create_bd_intf_pin -mode Slave -vlnv xilinx.com:interface:axis_rtl:1.0 S_AXIS
create_bd_intf_pin -mode Master -vlnv xilinx.com:interface:axis_rtl:1.0 M_AXIS
create_bd_pin -dir I cmac_clk
create_bd_pin -dir I cmac_resetn
create_bd_pin -dir I sys_clk
create_bd_pin -dir I sys_resetn
create_bd_pin -dir O -from 31 -to 0 bad_packet_count

create_bd_cell -type ip -vlnv xilinx.com:ip:axis_data_fifo:2.0 cdc_fifo
set_property -dict {CONFIG.FIFO_DEPTH 16 CONFIG.IS_ACLK_ASYNC 1} [get_bd_cells cdc_fifo]
create_bd_cell -type module -reference bad_packet_filter bad_packet_filter

# ---- hierarchy /qsfp0_rx ----
current_bd_instance /qsfp0_rx
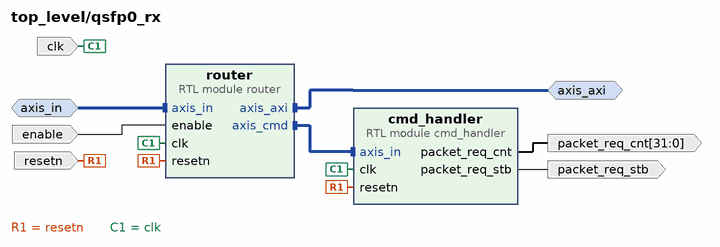
[diagram p16: block diagram inside /qsfp0_rx]
create_bd_intf_pin -mode Slave -vlnv xilinx.com:interface:axis_rtl:1.0 axis_in
create_bd_intf_pin -mode Master -vlnv xilinx.com:interface:axis_rtl:1.0 axis_axi
create_bd_pin -dir I -type clk clk
create_bd_pin -dir I -type rst resetn
create_bd_pin -dir O packet_req_stb
create_bd_pin -dir O -from 31 -to 0 packet_req_cnt
create_bd_pin -dir I enable

create_bd_cell -type module -reference cmd_handler cmd_handler
create_bd_cell -type module -reference router router

# ---- hierarchy /qsfp1_rx ----
current_bd_instance /qsfp1_rx
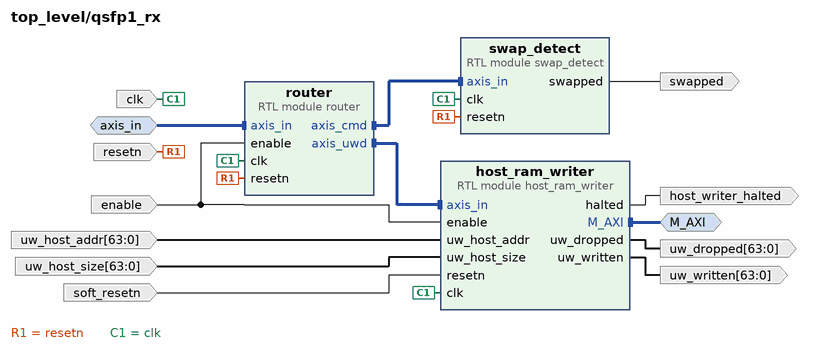
[diagram p17: block diagram inside /qsfp1_rx]
create_bd_intf_pin -mode Master -vlnv xilinx.com:interface:aximm_rtl:1.0 M_AXI
create_bd_intf_pin -mode Slave -vlnv xilinx.com:interface:axis_rtl:1.0 axis_in
create_bd_pin -dir I -type clk clk
create_bd_pin -dir I -type rst resetn
create_bd_pin -dir I enable
create_bd_pin -dir I -from 63 -to 0 uw_host_size
create_bd_pin -dir I -from 63 -to 0 uw_host_addr
create_bd_pin -dir O -from 63 -to 0 uw_written
create_bd_pin -dir O -from 63 -to 0 uw_dropped
create_bd_pin -dir O swapped
create_bd_pin -dir O host_writer_halted
create_bd_pin -dir I soft_resetn

create_bd_cell -type module -reference host_ram_writer host_ram_writer
create_bd_cell -type module -reference router router
create_bd_cell -type module -reference swap_detect swap_detect

# ---- hierarchy /ecd_axi ----
current_bd_instance /ecd_axi
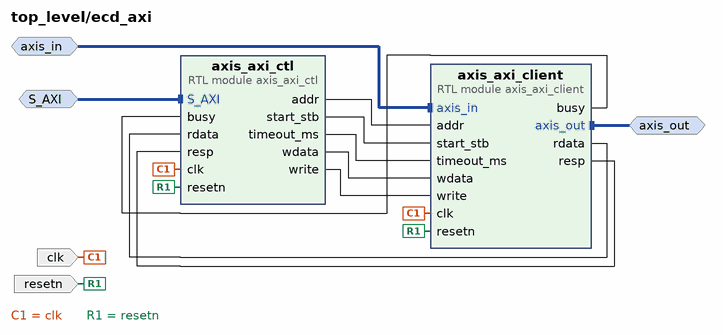
[diagram p18: block diagram inside /ecd_axi]
create_bd_intf_pin -mode Slave -vlnv xilinx.com:interface:aximm_rtl:1.0 S_AXI
create_bd_intf_pin -mode Master -vlnv xilinx.com:interface:axis_rtl:1.0 axis_out
create_bd_intf_pin -mode Slave -vlnv xilinx.com:interface:axis_rtl:1.0 axis_in
create_bd_pin -dir I -type clk clk
create_bd_pin -dir I -type rst resetn

create_bd_cell -type module -reference axis_axi_client axis_axi_client
create_bd_cell -type module -reference axis_axi_ctl axis_axi_ctl

# ---- connections ----

current_bd_instance /pcie
connect_bd_intf_net [get_bd_intf_pins register_sc/M00_AXI] [get_bd_intf_pins M00_AXI]
connect_bd_intf_net [get_bd_intf_pins register_sc/M01_AXI] [get_bd_intf_pins M01_AXI]
connect_bd_intf_net [get_bd_intf_pins pcie0_refclk] [get_bd_intf_pins clock_buffer_0/CLK_IN_D]
connect_bd_intf_net [get_bd_intf_pins pcie1_refclk] [get_bd_intf_pins clock_buffer_1/CLK_IN_D]
connect_bd_intf_net [get_bd_intf_pins S_AXI_FDATA0] [get_bd_intf_pins smartconnect_0/S00_AXI]
connect_bd_intf_net [get_bd_intf_pins S_AXI_FDATA1] [get_bd_intf_pins axi_clock_converter_1/S_AXI]
connect_bd_intf_net [get_bd_intf_pins S_AXI_UWDATA] [get_bd_intf_pins smartconnect_0/S01_AXI]
connect_bd_intf_net [get_bd_intf_pins axi4_lite_plug_0/M_AXI] [get_bd_intf_pins pcie_bridge_0/S_AXI_LITE]
connect_bd_intf_net [get_bd_intf_pins axi4_lite_plug_1/M_AXI] [get_bd_intf_pins pcie_bridge_1/S_AXI_LITE]
connect_bd_intf_net [get_bd_intf_pins axi_clock_converter_1/M_AXI] [get_bd_intf_pins pcie_bridge_1/S_AXI_B]
connect_bd_intf_net [get_bd_intf_pins pcie_bridge_0/M_AXI_B] [get_bd_intf_pins register_sc/S00_AXI]
connect_bd_intf_net [get_bd_intf_pins pcie_mgt_0] [get_bd_intf_pins pcie_bridge_0/pcie_mgt]
connect_bd_intf_net [get_bd_intf_pins pcie_mgt_1] [get_bd_intf_pins pcie_bridge_1/pcie_mgt]
connect_bd_intf_net [get_bd_intf_pins axi_revision/S_AXI] [get_bd_intf_pins register_sc/M02_AXI]
connect_bd_intf_net [get_bd_intf_pins M03_AXI] [get_bd_intf_pins register_sc/M03_AXI]
connect_bd_intf_net [get_bd_intf_pins pcie_bridge_0/S_AXI_B] [get_bd_intf_pins smartconnect_0/M00_AXI]
connect_bd_net -net clock_buffer_1_IBUF_DS_ODIV2 [get_bd_pins clock_buffer_0/IBUF_DS_ODIV2] [get_bd_pins pcie_bridge_0/sys_clk]
connect_bd_net -net clock_buffer_1_IBUF_OUT [get_bd_pins clock_buffer_0/IBUF_OUT] [get_bd_pins pcie_bridge_0/sys_clk_gt]
connect_bd_net -net clock_buffer_IBUF_DS_ODIV2 [get_bd_pins clock_buffer_1/IBUF_DS_ODIV2] [get_bd_pins pcie_bridge_1/sys_clk]
connect_bd_net -net clock_buffer_IBUF_OUT [get_bd_pins clock_buffer_1/IBUF_OUT] [get_bd_pins pcie_bridge_1/sys_clk_gt]
connect_bd_net [get_bd_pins pcie_bridge_0/axi_aclk] \
  [get_bd_pins axi_aclk] [get_bd_pins smartconnect_0/aclk] [get_bd_pins axi4_lite_plug_0/clk] \
  [get_bd_pins axi_clock_converter_1/s_axi_aclk] [get_bd_pins register_sc/aclk] [get_bd_pins axi_revision/AXI_ACLK]
connect_bd_net [get_bd_pins pcie_bridge_0/axi_aresetn] \
  [get_bd_pins axi_aresetn] [get_bd_pins smartconnect_0/aresetn] [get_bd_pins axi_clock_converter_1/s_axi_aresetn] \
  [get_bd_pins register_sc/aresetn] [get_bd_pins axi_revision/AXI_ARESETN]
connect_bd_net [get_bd_pins pcie_bridge_1/axi_aclk] [get_bd_pins axi4_lite_plug_1/clk] [get_bd_pins axi_clock_converter_1/m_axi_aclk]
connect_bd_net [get_bd_pins pcie_bridge_1/axi_aresetn] [get_bd_pins axi_clock_converter_1/m_axi_aresetn]
connect_bd_net -net sys_rst_n_0_1 [get_bd_pins pcie_perst_l] [get_bd_pins pcie_bridge_1/sys_rst_n] [get_bd_pins pcie_bridge_0/sys_rst_n]

current_bd_instance /feeder
connect_bd_intf_net [get_bd_intf_pins M_AXI_RAM1] [get_bd_intf_pins channel_1/M_AXI]
connect_bd_intf_net [get_bd_intf_pins axis_out1] [get_bd_intf_pins channel_1/axis_out]
connect_bd_intf_net [get_bd_intf_pins axis_out0] [get_bd_intf_pins channel_0/axis_out]
connect_bd_intf_net [get_bd_intf_pins hbm0_refclk] [get_bd_intf_pins channel_0/hbm_refclk]
connect_bd_intf_net [get_bd_intf_pins hbm1_refclk] [get_bd_intf_pins channel_1/hbm_refclk]
connect_bd_intf_net [get_bd_intf_pins S_AXI] [get_bd_intf_pins control/S_AXI]
connect_bd_intf_net [get_bd_intf_pins M_AXI_RAM0] [get_bd_intf_pins channel_0/M_AXI]
connect_bd_net [get_bd_pins channel_0/emitter_halted] [get_bd_pins control/emitter_halted_0]
connect_bd_net [get_bd_pins channel_0/emitter_stall] [get_bd_pins control/emitter_stall_0]
connect_bd_net [get_bd_pins channel_0/error] [get_bd_pins control/selftest_err_0]
connect_bd_net [get_bd_pins channel_0/fifo_full] [get_bd_pins control/fifo_full_0]
connect_bd_net [get_bd_pins channel_0/hbm_cattrip] [get_bd_pins control/cattrip_0]
connect_bd_net [get_bd_pins channel_0/hbm_reader_halted] [get_bd_pins control/hbm_reader_halted_0]
connect_bd_net [get_bd_pins channel_0/hbm_temp] [get_bd_pins control/hbm_temp_0]
connect_bd_net [get_bd_pins channel_0/hbm_writer_halted] [get_bd_pins control/hbm_writer_halted_0]
connect_bd_net [get_bd_pins channel_0/host_read_error] [get_bd_pins control/host_read_error_0]
connect_bd_net [get_bd_pins channel_0/packets_req] [get_bd_pins control/packets_req_0]
connect_bd_net [get_bd_pins channel_0/packets_sent] [get_bd_pins control/packets_sent_0]
connect_bd_net [get_bd_pins channel_1/emitter_halted] [get_bd_pins control/emitter_halted_1]
connect_bd_net -net channel_1_emitter_stall_error [get_bd_pins channel_1/emitter_stall] [get_bd_pins control/emitter_stall_1]
connect_bd_net [get_bd_pins channel_1/error] [get_bd_pins control/selftest_err_1]
connect_bd_net [get_bd_pins channel_1/fifo_full] [get_bd_pins control/fifo_full_1]
connect_bd_net [get_bd_pins channel_1/half_frames_consumed] [get_bd_pins control/half_frames_consumed_1]
connect_bd_net -net channel_1_halted [get_bd_pins channel_1/host_reader_halted] [get_bd_pins control/reader_halted_1]
connect_bd_net [get_bd_pins channel_1/hbm_cattrip] [get_bd_pins control/cattrip_1]
connect_bd_net [get_bd_pins channel_1/hbm_reader_halted] [get_bd_pins control/hbm_reader_halted_1]
connect_bd_net [get_bd_pins channel_1/hbm_temp] [get_bd_pins control/hbm_temp_1]
connect_bd_net [get_bd_pins channel_1/hbm_writer_halted] [get_bd_pins control/hbm_writer_halted_1]
connect_bd_net [get_bd_pins channel_1/host_read_error] [get_bd_pins control/host_read_error_1]
connect_bd_net [get_bd_pins channel_1/packets_req] [get_bd_pins control/packets_req_1]
connect_bd_net [get_bd_pins channel_1/packets_sent] [get_bd_pins control/packets_sent_1]
connect_bd_net [get_bd_pins control/cattrip] [get_bd_pins cattrip]
connect_bd_net [get_bd_pins control/enable] [get_bd_pins channel_0/enable] [get_bd_pins channel_1/enable] [get_bd_pins enable]
connect_bd_net [get_bd_pins control/fd_host_addr] [get_bd_pins channel_0/fd_host_addr] [get_bd_pins channel_1/fd_host_addr]
connect_bd_net [get_bd_pins control/fd_host_size] [get_bd_pins channel_0/fd_host_size] [get_bd_pins channel_1/fd_host_size]
connect_bd_net [get_bd_pins control/host_frame_size] [get_bd_pins channel_0/host_frame_size] [get_bd_pins channel_1/host_frame_size]
connect_bd_net [get_bd_pins control/resetn_out] [get_bd_pins channel_0/soft_resetn] [get_bd_pins channel_1/soft_resetn] [get_bd_pins soft_resetn]
connect_bd_net [get_bd_pins control/selftest_size] [get_bd_pins channel_0/selftest_size] [get_bd_pins channel_1/selftest_size]
connect_bd_net [get_bd_pins control/send_cnt] [get_bd_pins channel_0/local_send_cnt] [get_bd_pins channel_1/local_send_cnt]
connect_bd_net [get_bd_pins control/send_stb] [get_bd_pins channel_0/local_send_stb] [get_bd_pins channel_1/local_send_stb]
connect_bd_net [get_bd_pins control/use_sim_data] [get_bd_pins channel_0/use_sim_data] [get_bd_pins channel_1/use_sim_data]
connect_bd_net -net pcie_axi_aclk [get_bd_pins clk] [get_bd_pins channel_0/clk] [get_bd_pins channel_1/clk] [get_bd_pins control/clk]
connect_bd_net -net pcie_axi_aresetn [get_bd_pins resetn] [get_bd_pins channel_0/resetn] [get_bd_pins channel_1/resetn] [get_bd_pins control/resetn]
connect_bd_net -net ram_reader_0_half_frames_consumed [get_bd_pins channel_0/half_frames_consumed] [get_bd_pins control/half_frames_consumed_0]
connect_bd_net -net ram_reader_0_halted [get_bd_pins channel_0/host_reader_halted] [get_bd_pins control/reader_halted_0]
connect_bd_net [get_bd_pins remote_send_cnt] [get_bd_pins channel_0/remote_send_cnt] [get_bd_pins channel_1/remote_send_cnt]
connect_bd_net [get_bd_pins remote_send_stb] [get_bd_pins channel_0/remote_send_stb] [get_bd_pins channel_1/remote_send_stb]
connect_bd_net [get_bd_pins uw_writer_halted] [get_bd_pins control/uw_writer_halted]

current_bd_instance /feeder/channel_0
connect_bd_intf_net [get_bd_intf_pins axis_out] [get_bd_intf_pins fd_emitter/axis_out]
connect_bd_intf_net [get_bd_intf_pins axis_out] [get_bd_intf_pins fifo_selftest/i_pkt_in]
connect_bd_intf_net [get_bd_intf_pins hbm_fifo/axis_out] [get_bd_intf_pins fd_emitter/axis_in]
connect_bd_intf_net [get_bd_intf_pins hbm_fifo/axis_out] [get_bd_intf_pins fifo_selftest/i_raw_in]
connect_bd_intf_net [get_bd_intf_pins hbm_refclk] [get_bd_intf_pins hbm_fifo/hbm_refclk]
connect_bd_intf_net [get_bd_intf_pins M_AXI] [get_bd_intf_pins host_ram_reader/M_AXI]
connect_bd_intf_net [get_bd_intf_pins host_ram_reader/axis_out] [get_bd_intf_pins hbm_fifo/axis_in]
connect_bd_net -net control_fd_host_size [get_bd_pins fd_host_size] [get_bd_pins host_ram_reader/i_fd_host_size]
connect_bd_net -net control_resetn_out [get_bd_pins soft_resetn] \
  [get_bd_pins hbm_fifo/soft_resetn] [get_bd_pins fd_emitter/resetn] [get_bd_pins host_ram_reader/resetn] \
  [get_bd_pins fifo_selftest/resetn]
connect_bd_net -net control_send_cnt [get_bd_pins local_send_cnt] [get_bd_pins fd_emitter/local_send_cnt]
connect_bd_net -net control_send_stb [get_bd_pins local_send_stb] [get_bd_pins fd_emitter/local_send_stb]
connect_bd_net [get_bd_pins enable] [get_bd_pins fd_emitter/enable] [get_bd_pins host_ram_reader/i_enable] [get_bd_pins hbm_fifo/enable]
connect_bd_net [get_bd_pins fd_emitter/halted] [get_bd_pins emitter_halted]
connect_bd_net [get_bd_pins fd_emitter/packets_req] [get_bd_pins packets_req]
connect_bd_net [get_bd_pins fd_emitter/packets_sent] [get_bd_pins packets_sent]
connect_bd_net [get_bd_pins fd_emitter/stall_error] [get_bd_pins emitter_stall]
connect_bd_net [get_bd_pins fd_host_addr] [get_bd_pins host_ram_reader/i_fd_host_addr]
connect_bd_net [get_bd_pins fifo_selftest/error] [get_bd_pins error]
connect_bd_net [get_bd_pins hbm_fifo/fifo_full] [get_bd_pins fifo_full]
connect_bd_net [get_bd_pins hbm_fifo/hbm_cattrip] [get_bd_pins hbm_cattrip]
connect_bd_net [get_bd_pins hbm_fifo/hbm_reader_halted] [get_bd_pins hbm_reader_halted]
connect_bd_net [get_bd_pins hbm_fifo/hbm_temp] [get_bd_pins hbm_temp]
connect_bd_net [get_bd_pins hbm_fifo/hbm_writer_halted] [get_bd_pins hbm_writer_halted]
connect_bd_net [get_bd_pins host_frame_size] [get_bd_pins host_ram_reader/i_host_frame_size]
connect_bd_net -net host_ram_reader_0_half_frames_consumed [get_bd_pins host_ram_reader/half_frames_consumed] [get_bd_pins half_frames_consumed]
connect_bd_net -net host_ram_reader_0_halted [get_bd_pins host_ram_reader/halted] [get_bd_pins host_reader_halted]
connect_bd_net [get_bd_pins host_ram_reader/read_error] [get_bd_pins host_read_error]
connect_bd_net -net pcie_axi_aclk [get_bd_pins clk] \
  [get_bd_pins hbm_fifo/clk] [get_bd_pins fd_emitter/clk] [get_bd_pins host_ram_reader/clk] [get_bd_pins fifo_selftest/clk]
connect_bd_net [get_bd_pins remote_send_cnt] [get_bd_pins fd_emitter/remote_send_cnt]
connect_bd_net [get_bd_pins remote_send_stb] [get_bd_pins fd_emitter/remote_send_stb]
connect_bd_net [get_bd_pins resetn] [get_bd_pins hbm_fifo/resetn]
connect_bd_net [get_bd_pins selftest_size] [get_bd_pins fifo_selftest/selftest_size]
connect_bd_net [get_bd_pins use_sim_data] [get_bd_pins host_ram_reader/i_use_sim_data]

current_bd_instance /feeder/channel_0/hbm_fifo
connect_bd_intf_net [get_bd_intf_pins hbm/S01_AXI] [get_bd_intf_pins hbm_reader/M_AXI]
connect_bd_intf_net [get_bd_intf_pins axis_in] [get_bd_intf_pins hbm_writer/axis_in]
connect_bd_intf_net [get_bd_intf_pins axis_out] [get_bd_intf_pins hbm_reader/axis_out]
connect_bd_intf_net [get_bd_intf_pins hbm_refclk] [get_bd_intf_pins hbm/hbm_refclk]
connect_bd_intf_net [get_bd_intf_pins hbm_writer/M_AXI] [get_bd_intf_pins hbm/S00_AXI]
connect_bd_net [get_bd_pins clk] \
  [get_bd_pins hbm/axi_nn_aclk] [get_bd_pins hbm/clk] [get_bd_pins hbm_writer/clk] [get_bd_pins hbm_manager/clk] \
  [get_bd_pins hbm_reader/clk]
connect_bd_net [get_bd_pins enable] [get_bd_pins hbm_writer/enable] [get_bd_pins hbm_reader/enable]
connect_bd_net -net hbm_0_hbm_cattrip [get_bd_pins hbm/hbm_cattrip] [get_bd_pins hbm_cattrip]
connect_bd_net -net hbm_0_hbm_temp [get_bd_pins hbm/hbm_temp] [get_bd_pins hbm_temp]
connect_bd_net -net hbm_manager_0_blocks_to_read [get_bd_pins hbm_manager/blocks_to_read] [get_bd_pins hbm_reader/blocks_to_read]
connect_bd_net -net hbm_manager_0_halt_req_stb [get_bd_pins hbm_manager/halt_req_stb] [get_bd_pins hbm_writer/halt_req_stb]
connect_bd_net -net hbm_manager_0_read_bank_select [get_bd_pins hbm_manager/read_bank_select] [get_bd_pins hbm_reader/bank_select]
connect_bd_net -net hbm_manager_0_start_reader_stb [get_bd_pins hbm_manager/start_reader_stb] [get_bd_pins hbm_reader/start_stb]
connect_bd_net -net hbm_manager_0_start_writer_stb [get_bd_pins hbm_manager/start_writer_stb] [get_bd_pins hbm_writer/start_stb]
connect_bd_net -net hbm_manager_0_write_bank_select [get_bd_pins hbm_manager/write_bank_select] [get_bd_pins hbm_writer/bank_select]
connect_bd_net -net hbm_reader_0_fifo_full [get_bd_pins hbm_reader/fifo_full] [get_bd_pins fifo_full]
connect_bd_net -net hbm_reader_0_idle [get_bd_pins hbm_reader/idle] [get_bd_pins hbm_manager/reader_idle]
connect_bd_net [get_bd_pins hbm_reader/halted] [get_bd_pins hbm_reader_halted]
connect_bd_net -net hbm_writer_0_blocks_stored_in_hbm [get_bd_pins hbm_writer/blocks_stored_in_hbm] [get_bd_pins hbm_manager/blocks_stored_in_hbm]
connect_bd_net -net hbm_writer_0_idle [get_bd_pins hbm_writer/idle] [get_bd_pins hbm_manager/writer_idle]
connect_bd_net [get_bd_pins hbm_writer/halted] [get_bd_pins hbm_writer_halted]
connect_bd_net -net resetn_1 [get_bd_pins soft_resetn] \
  [get_bd_pins hbm_writer/resetn] [get_bd_pins hbm_manager/resetn] [get_bd_pins hbm_reader/resetn]
connect_bd_net [get_bd_pins resetn] [get_bd_pins hbm/resetn] [get_bd_pins hbm/axi_nn_resetn]

current_bd_instance /feeder/channel_0/hbm_fifo/hbm
connect_bd_intf_net [get_bd_intf_pins S00_AXI] [get_bd_intf_pins main_crossbar/S00_AXI]
connect_bd_intf_net [get_bd_intf_pins S01_AXI] [get_bd_intf_pins main_crossbar/S01_AXI]
connect_bd_intf_net [get_bd_intf_pins smartconnect_0/S00_AXI] [get_bd_intf_pins bank0_splitter/M0_AXI]
connect_bd_intf_net [get_bd_intf_pins smartconnect_1/S00_AXI] [get_bd_intf_pins bank0_splitter/M1_AXI]
connect_bd_intf_net [get_bd_intf_pins smartconnect_2/S00_AXI] [get_bd_intf_pins bank1_splitter/M0_AXI]
connect_bd_intf_net [get_bd_intf_pins smartconnect_3/S00_AXI] [get_bd_intf_pins bank1_splitter/M1_AXI]
connect_bd_intf_net [get_bd_intf_pins hbm_refclk] [get_bd_intf_pins clock_buffer/CLK_IN_D]
connect_bd_intf_net [get_bd_intf_pins main_crossbar/M00_AXI] [get_bd_intf_pins bank0_splitter/S_AXI]
connect_bd_intf_net [get_bd_intf_pins main_crossbar/M01_AXI] [get_bd_intf_pins bank1_splitter/S_AXI]
connect_bd_intf_net [get_bd_intf_pins smartconnect_0/M00_AXI] [get_bd_intf_pins hbm_0/SAXI_00_8HI]
connect_bd_intf_net [get_bd_intf_pins smartconnect_0/M01_AXI] [get_bd_intf_pins hbm_0/SAXI_01_8HI]
connect_bd_intf_net [get_bd_intf_pins smartconnect_0/M02_AXI] [get_bd_intf_pins hbm_0/SAXI_02_8HI]
connect_bd_intf_net [get_bd_intf_pins smartconnect_0/M03_AXI] [get_bd_intf_pins hbm_0/SAXI_03_8HI]
connect_bd_intf_net [get_bd_intf_pins smartconnect_1/M00_AXI] [get_bd_intf_pins hbm_0/SAXI_04_8HI]
connect_bd_intf_net [get_bd_intf_pins smartconnect_1/M01_AXI] [get_bd_intf_pins hbm_0/SAXI_05_8HI]
connect_bd_intf_net [get_bd_intf_pins smartconnect_1/M02_AXI] [get_bd_intf_pins hbm_0/SAXI_06_8HI]
connect_bd_intf_net [get_bd_intf_pins smartconnect_1/M03_AXI] [get_bd_intf_pins hbm_0/SAXI_07_8HI]
connect_bd_intf_net [get_bd_intf_pins smartconnect_2/M00_AXI] [get_bd_intf_pins hbm_0/SAXI_08_8HI]
connect_bd_intf_net [get_bd_intf_pins smartconnect_2/M01_AXI] [get_bd_intf_pins hbm_0/SAXI_09_8HI]
connect_bd_intf_net [get_bd_intf_pins smartconnect_2/M02_AXI] [get_bd_intf_pins hbm_0/SAXI_10_8HI]
connect_bd_intf_net [get_bd_intf_pins smartconnect_2/M03_AXI] [get_bd_intf_pins hbm_0/SAXI_11_8HI]
connect_bd_intf_net [get_bd_intf_pins smartconnect_3/M00_AXI] [get_bd_intf_pins hbm_0/SAXI_12_8HI]
connect_bd_intf_net [get_bd_intf_pins smartconnect_3/M01_AXI] [get_bd_intf_pins hbm_0/SAXI_13_8HI]
connect_bd_intf_net [get_bd_intf_pins smartconnect_3/M02_AXI] [get_bd_intf_pins hbm_0/SAXI_14_8HI]
connect_bd_intf_net [get_bd_intf_pins smartconnect_3/M03_AXI] [get_bd_intf_pins hbm_0/SAXI_15_8HI]
connect_bd_net [get_bd_pins axi_nn_aclk] \
  [get_bd_pins hbm_0/AXI_01_ACLK] [get_bd_pins hbm_0/AXI_00_ACLK] [get_bd_pins hbm_0/AXI_02_ACLK] \
  [get_bd_pins hbm_0/AXI_03_ACLK] [get_bd_pins hbm_0/AXI_04_ACLK] [get_bd_pins hbm_0/AXI_05_ACLK] \
  [get_bd_pins hbm_0/AXI_07_ACLK] [get_bd_pins hbm_0/AXI_06_ACLK] [get_bd_pins hbm_0/AXI_10_ACLK] \
  [get_bd_pins hbm_0/AXI_09_ACLK] [get_bd_pins hbm_0/AXI_08_ACLK] [get_bd_pins hbm_0/AXI_15_ACLK] \
  [get_bd_pins hbm_0/AXI_13_ACLK] [get_bd_pins hbm_0/AXI_11_ACLK] [get_bd_pins hbm_0/AXI_12_ACLK] \
  [get_bd_pins hbm_0/AXI_14_ACLK]
connect_bd_net [get_bd_pins axi_nn_resetn] \
  [get_bd_pins hbm_0/AXI_00_ARESET_N] [get_bd_pins hbm_0/AXI_03_ARESET_N] [get_bd_pins hbm_0/AXI_02_ARESET_N] \
  [get_bd_pins hbm_0/AXI_06_ARESET_N] [get_bd_pins hbm_0/AXI_04_ARESET_N] [get_bd_pins hbm_0/AXI_01_ARESET_N] \
  [get_bd_pins hbm_0/AXI_05_ARESET_N] [get_bd_pins hbm_0/AXI_08_ARESET_N] [get_bd_pins hbm_0/AXI_07_ARESET_N] \
  [get_bd_pins hbm_0/AXI_10_ARESET_N] [get_bd_pins hbm_0/AXI_09_ARESET_N] [get_bd_pins hbm_0/AXI_12_ARESET_N] \
  [get_bd_pins hbm_0/AXI_13_ARESET_N] [get_bd_pins hbm_0/AXI_14_ARESET_N] [get_bd_pins hbm_0/AXI_15_ARESET_N] \
  [get_bd_pins hbm_0/AXI_11_ARESET_N]
connect_bd_net [get_bd_pins clk] \
  [get_bd_pins main_crossbar/aclk] [get_bd_pins smartconnect_0/aclk] [get_bd_pins smartconnect_1/aclk] \
  [get_bd_pins smartconnect_2/aclk] [get_bd_pins smartconnect_3/aclk] [get_bd_pins bank0_splitter/clk] \
  [get_bd_pins bank1_splitter/clk]
connect_bd_net [get_bd_pins clock_buffer/IBUF_OUT] [get_bd_pins hbm_0/APB_0_PCLK] [get_bd_pins hbm_0/HBM_REF_CLK_0]
connect_bd_net [get_bd_pins hbm_0/DRAM_0_STAT_CATTRIP] [get_bd_pins hbm_cattrip]
connect_bd_net [get_bd_pins hbm_0/DRAM_0_STAT_TEMP] [get_bd_pins hbm_temp]
connect_bd_net [get_bd_pins one/dout] [get_bd_pins hbm_0/APB_0_PRESET_N]
connect_bd_net [get_bd_pins resetn] \
  [get_bd_pins main_crossbar/aresetn] [get_bd_pins smartconnect_0/aresetn] [get_bd_pins smartconnect_1/aresetn] \
  [get_bd_pins smartconnect_2/aresetn] [get_bd_pins smartconnect_3/aresetn] [get_bd_pins bank0_splitter/resetn] \
  [get_bd_pins bank1_splitter/resetn]
